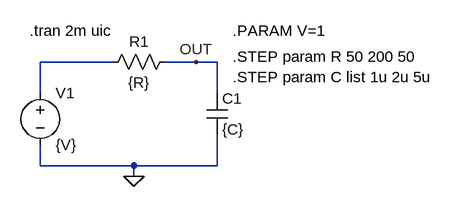
[diagram p0: schematic Fig_4-26_STEP-2param.asc]
Fig_4-26_STEP-2param.asc, the LTspice schematic file:
Version 4
SHEET 1 880 680
WIRE 144 80 32 80
WIRE 272 80 224 80
WIRE 304 80 272 80
WIRE 32 128 32 80
WIRE 304 128 304 80
WIRE 32 240 32 208
WIRE 176 240 32 240
WIRE 304 240 304 192
WIRE 304 240 176 240
WIRE 176 256 176 240
FLAG 176 256 0
FLAG 272 80 OUT
SYMBOL voltage 32 112 R0
SYMATTR InstName V1
SYMATTR Value {V}
SYMBOL res 128 96 R270
WINDOW 0 32 56 VTop 2
WINDOW 3 0 56 VBottom 2
SYMATTR InstName R1
SYMATTR Value {R}
SYMBOL cap 288 128 R0
SYMATTR InstName C1
SYMATTR Value {C}
TEXT 16 32 Left 2 !.tran 2m uic
TEXT 328 32 Left 2 !.PARAM V=1
TEXT 328 72 Left 2 !.STEP param R 50 200 50\n.STEP param C list 1u 2u 5u

The netlist it stands for:
* Fig_4-26_STEP-2param.asc
V1 N001 0 {V}
R1 N001 OUT {R}
C1 OUT 0 {C}
.tran 2m uic
.PARAM V=1
.STEP param R 50 200 50
.STEP param C list 1u 2u 5u
.backanno
.end